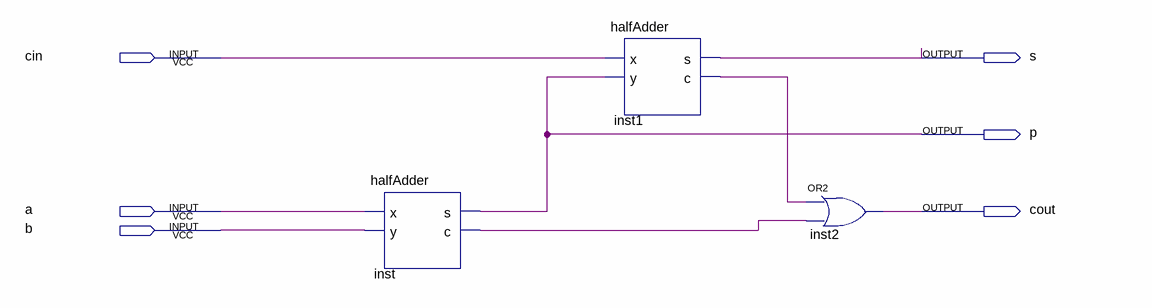
[diagram p0: schematic sheet]
// Quartus schematic carrySkipFullAdder.bdf as structural Verilog: 3 symbols, 6 pins
module carrySkipFullAdder (
  input  cin,
  input  a,
  input  b,
  output s,
  output p,
  output cout
);

  wire inst1_c, inst_c;

  halfAdder inst (.x(a), .y(b), .s(p), .c(inst_c));
  halfAdder inst1 (.x(cin), .y(p), .s(s), .c(inst1_c));
  or inst2 (cout, inst1_c, inst_c);
endmodule
